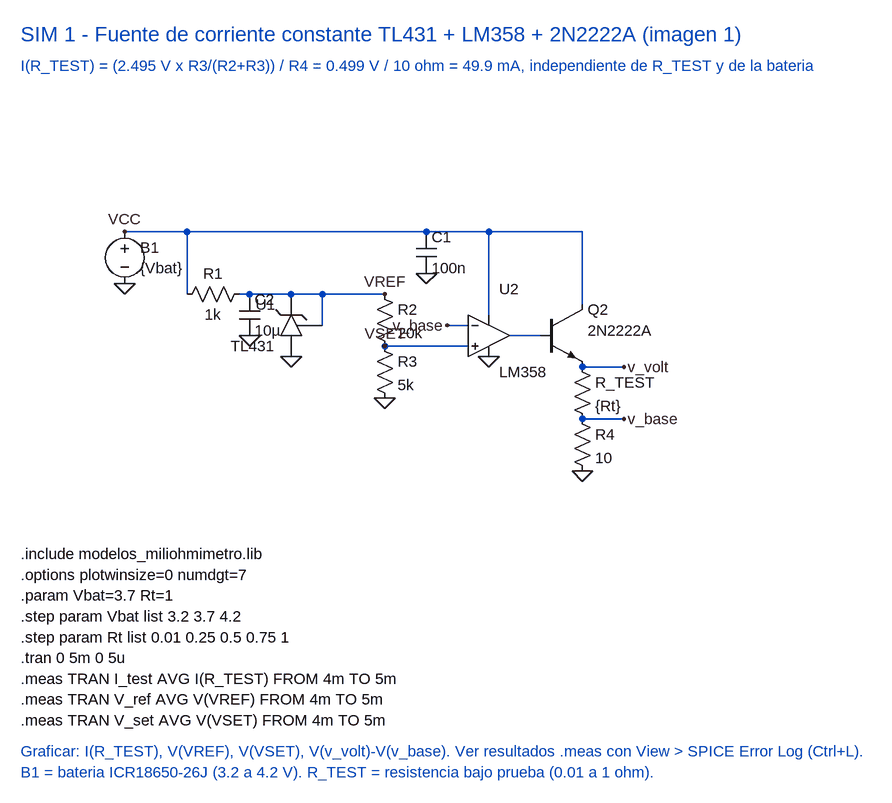
[diagram p0: schematic Sim1_Fuente_Corriente_TL431.asc]
Sim1_Fuente_Corriente_TL431.asc, the LTspice schematic file:
Version 4
SHEET 1 2400 1800
WIRE 0 -96 96 -96
WIRE 96 -96 560 -96
WIRE 560 -96 704 -96
WIRE 96 -96 96 0
WIRE 176 0 304 0
WIRE 304 0 400 0
WIRE 304 48 304 0
WIRE 400 80 528 80
WIRE 560 32 560 -96
WIRE 528 48 496 48
WIRE 592 64 640 64
WIRE 704 16 704 -96
WIRE 704 112 768 112
WIRE 704 192 768 192
FLAG 0 -16 0
FLAG 0 -96 VCC
FLAG 192 64 0
FLAG 256 96 0
FLAG 400 0 VREF
FLAG 400 160 0
FLAG 400 80 VSET
FLAG 464 -32 0
FLAG 560 96 0
FLAG 496 48 v_base
FLAG 704 272 0
FLAG 768 112 v_volt
FLAG 768 192 v_base
SYMBOL voltage 0 -112 R0
WINDOW 0 24 40 Left 2
WINDOW 3 24 72 Left 2
SYMATTR InstName B1
SYMATTR Value {Vbat}
SYMBOL res 192 -16 R90
WINDOW 0 0 56 VBottom 2
WINDOW 3 32 56 VTop 2
SYMATTR InstName R1
SYMATTR Value 1k
SYMBOL cap 176 0 R0
WINDOW 0 24 8 Left 2
WINDOW 3 24 56 Left 2
SYMATTR InstName C2
SYMATTR Value 10µ
SYMBOL TL431 256 0 R0
SYMATTR InstName U1
SYMATTR Value TL431
SYMBOL res 384 -16 R0
WINDOW 0 36 40 Left 2
WINDOW 3 36 76 Left 2
SYMATTR InstName R2
SYMATTR Value 20k
SYMBOL res 384 64 R0
WINDOW 0 36 40 Left 2
WINDOW 3 36 76 Left 2
SYMATTR InstName R3
SYMATTR Value 5k
SYMBOL cap 448 -96 R0
WINDOW 0 24 8 Left 2
WINDOW 3 24 56 Left 2
SYMATTR InstName C1
SYMATTR Value 100n
SYMBOL OpAmps\\opamp2 560 0 R0
WINDOW 0 16 -8 Left 2
WINDOW 3 16 120 Left 2
SYMATTR InstName U2
SYMATTR Value LM358
SYMBOL npn 640 16 R0
WINDOW 0 72 8 Left 2
WINDOW 3 72 40 Left 2
SYMATTR InstName Q2
SYMATTR Value 2N2222A
SYMBOL res 688 96 R0
WINDOW 0 36 40 Left 2
WINDOW 3 36 76 Left 2
SYMATTR InstName R_TEST
SYMATTR Value {Rt}
SYMBOL res 688 176 R0
WINDOW 0 36 40 Left 2
WINDOW 3 36 76 Left 2
SYMATTR InstName R4
SYMATTR Value 10
TEXT -160 -400 Left 3 ;SIM 1 - Fuente de corriente constante TL431 + LM358 + 2N2222A (imagen 1)
TEXT -160 -352 Left 2 ;I(R_TEST) = (2.495 V x R3/(R2+R3)) / R4 = 0.499 V / 10 ohm = 49.9 mA, independiente de R_TEST y de la bateria
TEXT -160 400 Left 2 !.include modelos_miliohmimetro.lib
TEXT -160 432 Left 2 !.options plotwinsize=0 numdgt=7
TEXT -160 464 Left 2 !.param Vbat=3.7 Rt=1
TEXT -160 496 Left 2 !.step param Vbat list 3.2 3.7 4.2
TEXT -160 528 Left 2 !.step param Rt list 0.01 0.25 0.5 0.75 1
TEXT -160 560 Left 2 !.tran 0 5m 0 5u
TEXT -160 592 Left 2 !.meas TRAN I_test AVG I(R_TEST) FROM 4m TO 5m
TEXT -160 624 Left 2 !.meas TRAN V_ref AVG V(VREF) FROM 4m TO 5m
TEXT -160 656 Left 2 !.meas TRAN V_set AVG V(VSET) FROM 4m TO 5m
TEXT -160 704 Left 2 ;Graficar: I(R_TEST), V(VREF), V(VSET), V(v_volt)-V(v_base). Ver resultados .meas con View > SPICE Error Log (Ctrl+L).
TEXT -160 736 Left 2 ;B1 = bateria ICR18650-26J (3.2 a 4.2 V). R_TEST = resistencia bajo prueba (0.01 a 1 ohm).

The netlist it stands for:
* Sim1_Fuente_Corriente_TL431.asc
V§B1 VCC 0 {Vbat}
R1 VREF VCC 1k
C2 VREF 0 10µ
XU1 VREF 0 VREF TL431  ; pins K A REF
R2 VREF VSET 20k
R3 VSET 0 5k
C1 VCC 0 100n
XU2 VSET v_base VCC 0 N001 LM358  ; pins In+ In- V+ V- OUT
Q2 VCC N001 v_volt 0 2N2222A
R_TEST v_volt v_base {Rt}
R4 v_base 0 10
.model NPN NPN
.model PNP PNP
.lib standard.bjt
* SIM 1 - Fuente de corriente constante TL431 + LM358 + 2N2222A (imagen 1)
* I(R_TEST) = (2.495 V x R3/(R2+R3)) / R4 = 0.499 V / 10 ohm = 49.9 mA, independiente de R_TEST y de la bateria
.include modelos_miliohmimetro.lib
.options plotwinsize=0 numdgt=7
.param Vbat=3.7 Rt=1
.step param Vbat list 3.2 3.7 4.2
.step param Rt list 0.01 0.25 0.5 0.75 1
.tran 0 5m 0 5u
.meas TRAN I_test AVG I(R_TEST) FROM 4m TO 5m
.meas TRAN V_ref AVG V(VREF) FROM 4m TO 5m
.meas TRAN V_set AVG V(VSET) FROM 4m TO 5m
* Graficar: I(R_TEST), V(VREF), V(VSET), V(v_volt)-V(v_base). Ver resultados .meas con View > SPICE Error Log (Ctrl+L).
* B1 = bateria ICR18650-26J (3.2 a 4.2 V). R_TEST = resistencia bajo prueba (0.01 a 1 ohm).
.backanno
.end